# Altium schematic sheet Power_Management.SchDoc
size 419 x 297 mm; SheetNumber: 2; SheetTotal: 4
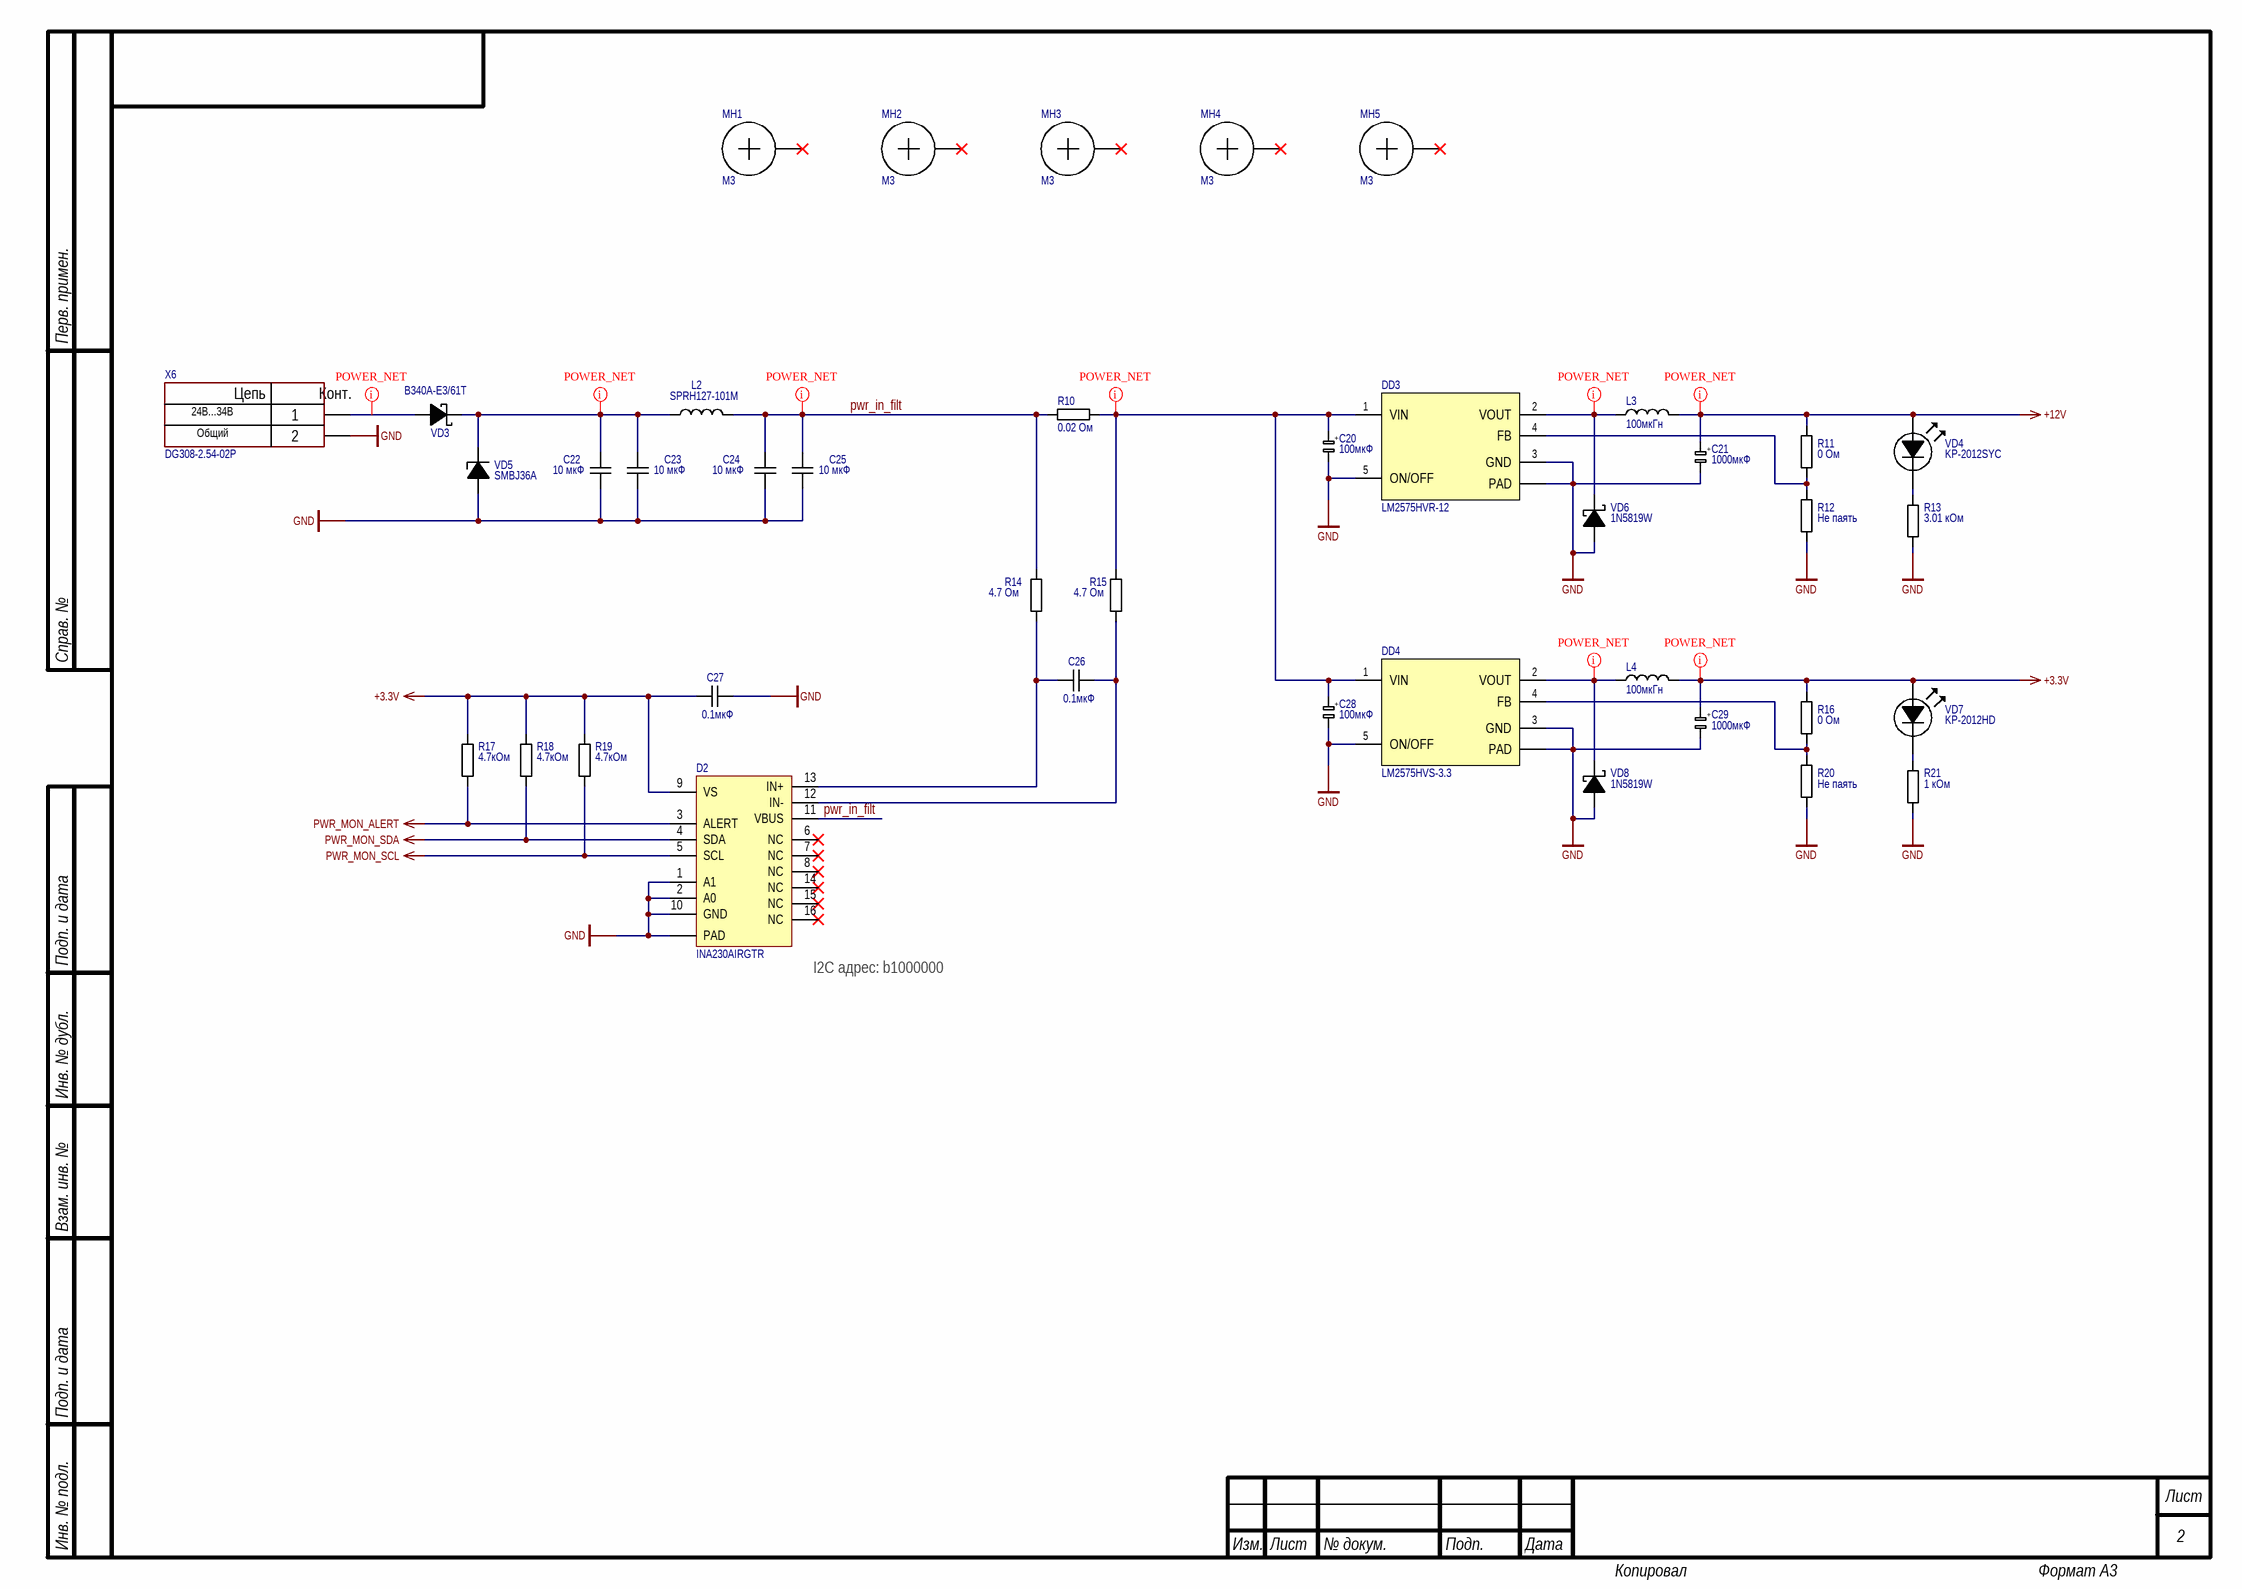
[diagram p0: Power_Management.SchDoc]

## Parts
C20  value 100мкФ  [CAP_RADIAL_10x20_P5]  (hidden comment: CAP-100мкФ-20%-100В-105°C-Radial)
C21  value 1000мкФ  [CAP_RADIAL_10x20_P5]  (hidden comment: CAP-1000мкФ-20%-25В-105°C-Radial)
C22  value 10 мкФ  [CAP_1206]  (hidden comment: CAP-10 мкФ-10%-50 В-X5R-1206)
C23  value 10 мкФ  [CAP_1206]  (hidden comment: CAP-10 мкФ-10%-50 В-X5R-1206)
C24  value 10 мкФ  [CAP_1206]  (hidden comment: CAP-10 мкФ-10%-50 В-X5R-1206)
C25  value 10 мкФ  [CAP_1206]  (hidden comment: CAP-10 мкФ-10%-50 В-X5R-1206)
C26  value 0.1мкФ  [CAP-0603]  (hidden comment: CAP-0.1мкФ-10%-50В-X7R-0603)
C27  value 0.1мкФ  [CAP-0603]  (hidden comment: CAP-0.1мкФ-10%-50В-X7R-0603)
C28  value 100мкФ  [CAP_RADIAL_10x20_P5]  (hidden comment: CAP-100мкФ-20%-100В-105°C-Radial)
C29  value 1000мкФ  [CAP_RADIAL_10x20_P5]  (hidden comment: CAP-1000мкФ-20%-25В-105°C-Radial)
D2  INA230AIRGTR  [VQFN-16]
DD3  LM2575HVR-12  [TO-263-5]
DD4  LM2575HVS-3.3  [TO-263-5]
L2  SPRH127-101M  [IND_SPRH127-101M]
L3  100мкГн  [IND_10.4X10.4]
L4  100мкГн  [IND_10.4X10.4]
MH1  M3  [M3]  (no BOM)
MH2  M3  [M3]  (no BOM)
MH3  M3  [M3]  (no BOM)
MH4  M3  [M3]  (no BOM)
MH5  M3  [M3]  (no BOM)
R10  value 0.02 Ом  [RES-2512]  (hidden comment: RES-0.02 Ом-1%-3 Вт-2512)
R11  value 0 Ом  [RES-0402]  (hidden comment: RES-0 Ом-5%-0.062 Вт-0402)
R12  value Не паять  [RES-0402]  (hidden comment: RES-Не паять-----0402)
R13  value 3.01 кОм  [RES-0805]  (hidden comment: RES-3.01 кОм-1%-0.125Вт-0805)
R14  value 4.7 Ом  [RES-0402]  (hidden comment: RES-4.7 Ом-5%-0.062 Вт-0402)
R15  value 4.7 Ом  [RES-0402]  (hidden comment: RES-4.7 Ом-5%-0.062 Вт-0402)
R16  value 0 Ом  [RES-0402]  (hidden comment: RES-0 Ом-5%-0.062 Вт-0402)
R17  value 4.7кОм  [RES-0402]  (hidden comment: RES-4.7кОм-5%-0.062Вт-0402)
R18  value 4.7кОм  [RES-0402]  (hidden comment: RES-4.7кОм-5%-0.062Вт-0402)
R19  value 4.7кОм  [RES-0402]  (hidden comment: RES-4.7кОм-5%-0.062Вт-0402)
R20  value Не паять  [RES-0402]  (hidden comment: RES-Не паять-----0402)
R21  value 1 кОм  [RES-0805]  (hidden comment: RES-1 кОм-1%-0.125Вт-0805)
VD3  B340A-E3/61T  [DO-214AC]
VD4  KP-2012SYC  [LED 0805]
VD5  SMBJ36A  [DO-214AA]
VD6  1N5819W  [SOD-123]
VD7  KP-2012HD  [LED 0805]
VD8  1N5819W  [SOD-123]
X6  DG308-2.54-02P  Curciut 2: Общий  Curciut 1: 24В...34В  [DG30825402P1400AH]

## Nets
+3.3V: C27.1 C29.P D2.9(VS) L4.2 R16.2 R17.2 R18.2 R19.2 VD7.1(A)
+12V: C21.P L3.2 R11.2 VD4.1(A)
GND: C20.N C21.N C22.1 C23.1 C24.1 C25.1 C27.2 C28.N C29.N D2.1(A1) D2.2(A0) D2.10(GND) D2.PAD DD3.3(GND) DD3.5(ON/OFF) DD3.PAD DD4.3(GND) DD4.5(ON/OFF) DD4.PAD R12.1 R13.1 R20.1 R21.1 VD5.A VD6.1(A) VD8.1(A) X6.2
PWR_MON_ALERT: D2.3(ALERT) R17.1
PWR_MON_SCL: D2.5(SCL) R19.1
PWR_MON_SDA: D2.4(SDA) R18.1
pwr_in_filt: C24.2 C25.2 D2.11(VBUS) L2.2 R10.1 R14.2
NetC20_P: C20.P C28.P DD3.1(VIN) DD4.1(VIN) R10.2 R15.2
NetC22_2: C22.2 C23.2 L2.1 VD3.C VD5.C
NetC26_1: C26.1 D2.13(IN+) R14.1
NetC26_2: C26.2 D2.12(IN-) R15.1
NetDD3_2: DD3.2(VOUT) L3.1 VD6.2(K)
NetDD3_4: DD3.4(FB) R11.1 R12.2
NetDD4_2: DD4.2(VOUT) L4.1 VD8.2(K)
NetDD4_4: DD4.4(FB) R16.1 R20.2
NetR13_2: R13.2 VD4.2(C)
NetR21_2: R21.2 VD7.2(C)
NetVD3_A: VD3.A X6.1

Not connected (* = marked no-connect by the designer): D2 6(NC)* 7(NC)* 8(NC)* 14(NC)* 15(NC)* 16(NC)*; MH1 1*; MH2 1*; MH3 1*; MH4 1*; MH5 1*

## Layout directives
net class POWER_NET: +3.3V, +12V, NetC20_P, NetC22_2, NetDD3_2, NetDD4_2, NetVD3_A, pwr_in_filt

## Notes on the sheet
- (near D2) I2C адрес: b1000000
- Перв. примен.
- Справ. №
- Подп. и дата
- Инв. № дубл.
- Взам. инв. №
- Изм.
- Лист
- № докум.
- Подп.
- Дата
- Инв. № подл.
- Копировал
- Формат А3
- (in symbol DG308-2.54-02P) Цепь; Конт.
- (in symbol JRB1E102M05001000210000B) +
- (in symbol JRB2A101M05001000200000B) +

## Library data of the parts
C20 C28 = JRB2A101M05001000200000B: 100мкФ, 100В, 105°C, 20%, 10x20мм P:5мм, JRB2A101M05001000200000B (К50-35 имп.), Конденсатор электролитический алюминиевый; Tolerance: 20%; Voltage: 100В; Manufacturer Part Number: JRB2A101M05001000200000B; Supplier 1: https://www.chipdip.ru/product/100mkf-100v-105-c-20-10x20mm-p-5mm-jb-capacitors-9000565887; Temperature: 105°C
C21 C29 = JRB1E102M05001000210000B: 1000мкФ, 25В, 105°C, 20%, 10x21мм P:5мм, JRB1E102M05001000210000B (К50-35 имп.), Конденсатор электролитический алюминиевый; Tolerance: 20%; Voltage: 25В; Manufacturer Part Number: JRB1E102M05001000210000B; Supplier 1: https://www.chipdip.ru/product/1000mkf-25v-105-c-20-10x21mm-p-5mm-jb-capacitors-9000565924; Temperature: 105°C
C22-C25 = Cap_1206: Конденсатор; Manufacturer Part Number: GRM31CR61H106KA12L; Tolerance: 10%; Voltage: 50 В; Temperature: X5R; Supplier 1: https://www.chipdip.ru/product0/9000332404
C26 C27 = Cap_0603: Конденсатор; Manufacturer Part Number: GRM188R71H104K; Tolerance: 10%; Voltage: 50В; Temperature: X7R; Supplier 1: https://www.chipdip.ru/product/grm188r71h104k
D2 = INA230AIRGTR: 36-V, 16-bit, I²C output current, voltage and power monitor with alert 16-VQFN -40 to 125; Manufacturer: Texas Instruments; Supplier: Digikey; Supplier Part Number: 296-36594-1-ND; Manufacturer Part Number: INA230AIRGTR; RoHS: Yes; Category: Amplifiers - Op Amps, Buffer, Instrumentation; Stock: 3132; Pricing: 1=2,83, 10=2,543, 25=2,3988, 100=2,0437, 250=1,919, 500=1,67912, 1000=1,39128 (USD); ComponentLink1URL: https://datasheet.ciiva.com/15132/getdatasheetpartid-614336-15132773.pdf?src-supplier=Verical; ComponentLink1Description: https://datasheet.ciiva.com/15132/getdatasheetpartid-614336-15132773.pdf?src-supplier=Verical; ComponentLink2URL: https://datasheet.ciiva.com/2965/ina230-2965732.pdf?src-supplier=Avnet; ComponentLink2Description: https://datasheet.ciiva.com/2965/ina230-2965732.pdf?src-supplier=Avnet; ComponentLink3URL: https://datasheet.ciiva.com/29609/ina230-29609254.pdf?src-supplier=Digikey; ComponentLink3Description: https://datasheet.ciiva.com/29609/ina230-29609254.pdf?src-supplier=Digikey; ComponentLink4URL: https://datasheet.ciiva.com/29609/ina230-29609255.pdf?src-supplier=Digikey; ComponentLink4Description: https://datasheet.ciiva.com/29609/ina230-29609255.pdf?src-supplier=Digikey; ComponentLink5URL: https://datasheet.ciiva.com/29609/ina230-29609256.pdf?src-supplier=Digikey; ComponentLink5Description: https://datasheet.ciiva.com/29609/ina230-29609256.pdf?src-supplier=Digikey; Supplier 1: https://www.chipdip.ru/product0/8004605923?ysclid=m1f43nxnn781516536
DD3 = LM2575HVR-12: LM2575HVR-12, Понижающий DC-DC преобразователь, Uвх=до 60В, Uвых=+12В, 1А, 52кГц [TO-263-5L] (=LM2575HVS-12); Supplier 1: https://www.chipdip.ru/product/lm2575hvr-12-ponizhayuschiy-dc-dc-preobrazovatel-uvh-do-htc-9001087020
DD4 = LM2575HVS-3.3: LM2575HVS-3.3, Понижающий DC-DC преобразователь, Uвх=до 60В, Uвых=3.3В, 1А, 52кГц [TO-263-5L]; Supplier 1: https://www.chipdip.ru/product/lm2575hvs-3.3-ponizhayuschiy-dc-dc-preobrazovatel-umw-9001231209
L2 = SPRH127-101M: SMD Low Loss Power Inductor; Manufacturer: Codaca; Supplier: Digikey; Supplier Part Number: 4044-SPRH127-101MCT-ND; Manufacturer Part Number: SPRH127-101M; RoHS: No; Stock: 3159; Pricing: 1=1,13, 10=0,93, 100=0,7645 (USD); Supplier 1: https://www.chipdip.ru/product/sprh127-101m-100
L3 L4 = B82464G4104M000: Inductor Power Shielded Wirewound 100uH 20% 100KHz Ferrite 1.05A 0.22Ohm DCR Automotive T/R; Manufacturer: EPCOS; DC Resistance (DCR): 220mΩ; Inductance: 100µH; Number of Circuits: 1; Saturation Current: 1.15A; Self Resonant Frequency: 6.5MHz; Manufacturer Part Number: B82464G4104M000; RoHS: Compliant; Category: Fixed Inductors; Stock 1: 363; Pricing 1: 1=1,09 (GBP); Case/Package: SMD/SMT; China RoHS: Compliant; Contact Plating: Tin; Core Material: Ferrite; Country of Origin: Germany; DC Current: 1.05A; Depth: 10.4mm; Export Control Classification Number (ECCN) Code: EAR99; Height: 4.8mm; Harmonized Tariff Schedule (HTS) Code: 8504.50.80.00; Inductance Tolerance: 20%; Introduction Date: 2002-08-13; Lead Free: Lead Free; Length: 10.4mm; Lifecycle Status: EOL; Max Current Rating: 1.05A; Max DC Current: 1.05A; Max Length: 10.4mm; Max Operating Temperature: 125°C; Max Width: 10.4mm; Military Standard: Not; Min Operating Temperature: -55°C; Mount: Surface Mount; Number of Pins: 2; Number of Terminals: 2; Packaging: Cut Tape; REACH SVHC: Yes; Resistance: 220mΩ; RMS Current (Irms): 1.05A; Schedule B: 8504500000, 8504500000|8504500000|8504500000|8504500000|8504500000; Test Frequency: 100kHz; Tolerance: 20%; Width: 10.4mm; ComponentLink1URL: https://datasheet.octopart.com:443/B82464G4104M000-EPCOS-datasheet-138895962.pdf?src-supplier=IHS; ComponentLink1Description: https://datasheet.octopart.com:443/B82464G4104M000-EPCOS-datasheet-138895962.pdf?src-supplier=IHS; ComponentLink2URL: https://datasheet.octopart.com:443/B82464G4104M000-EPCOS-datasheet-12510517.pdf?src-supplier=Newark; ComponentLink2Description: https://datasheet.octopart.com:443/B82464G4104M000-EPCOS-datasheet-12510517.pdf?src-supplier=Newark; ComponentLink3URL: https://datasheet.octopart.com:443/B82464G4104M000-EPCOS-datasheet-10671.pdf?src-supplier=Newark; ComponentLink3Description: https://datasheet.octopart.com:443/B82464G4104M000-EPCOS-datasheet-10671.pdf?src-supplier=Newark; ComponentLink4URL: https://datasheet.octopart.com:443/B82464G4104M000-EPCOS-datasheet-8324944.pdf?src-supplier=Future+Electronics; ComponentLink4Description: https://datasheet.octopart.com:443/B82464G4104M000-EPCOS-datasheet-8324944.pdf?src-supplier=Future+Electronics; ComponentLink5URL: https://datasheet.octopart.com:443/B82464G4104M000-EPCOS-datasheet-47871567.pdf?src-supplier=Future+Electronics; ComponentLink5Description: https://datasheet.octopart.com:443/B82464G4104M000-EPCOS-datasheet-47871567.pdf?src-supplier=Future+Electronics; ComponentLink6URL: https://datasheet.octopart.com:443/B82464G4104M000-EPCOS-datasheet-38579530.pdf?src-supplier=element14+APAC; ComponentLink6Description: https://datasheet.octopart.com:443/B82464G4104M000-EPCOS-datasheet-38579530.pdf?src-supplier=element14+APAC; ComponentLink7URL: https://datasheet.octopart.com:443/B82464G4104M-EPCOS-datasheet-714.pdf?src-supplier=TME; ComponentLink7Description: https://datasheet.octopart.com:443/B82464G4104M-EPCOS-datasheet-714.pdf?src-supplier=TME; ComponentLink8URL: https://datasheet.octopart.com:443/B82464G4104M-EPCOS-datasheet-519163.pdf?src-supplier=Farnell; ComponentLink8Description: https://datasheet.octopart.com:443/B82464G4104M-EPCOS-datasheet-519163.pdf?src-supplier=Farnell; ComponentLink9URL: https://datasheet.octopart.com:443/B82464G4104M-EPCOS-datasheet-499776.pdf?src-supplier=Farnell; ComponentLink9Description: https://datasheet.octopart.com:443/B82464G4104M-EPCOS-datasheet-499776.pdf?src-supplier=Farnell; ComponentLink10URL: https://datasheet.octopart.com:443/B82464-G4104-M-EPCOS-datasheet-550296.pdf?src-supplier=Verical; ComponentLink10Description: https://datasheet.octopart.com:443/B82464-G4104-M-EPCOS-datasheet-550296.pdf?src-supplier=Verical; Supplier Part Number 1: 4960669; Supplier 1: https://www.chipdip.ru/product/b82464g4104m-100mkgn-1.05a-10x10-katushka-epcos-759264303?from=visited_product; Supplier: RS
MH1-MH5 = M3: отверстие М3
R10 = Res_2512: Резистор; Manufacturer Part Number: CRA2512-FZ-R020ELF; Power: 3 Вт; Tolerance: 1%; Supplier 1: https://www.chipdip.ru/product0/8002006585
R11 R16 = Res_0402: Резистор; Manufacturer Part Number: RC0402JR-070RL; Tolerance: 5%; Power: 0.062 Вт; Supplier 1: https://www.chipdip.ru/product/0.062w-0402-0-om-5
R12 R20 = Res_0402: Резистор; Tolerance: -; Power: -; Manufacturer Part Number: -; Supplier 1: -
R13 = Res_0805: Резистор; Manufacturer Part Number: RC0805FR-073K01L; Tolerance: 1%; Power: 0.125Вт; Supplier 1: https://www.chipdip.ru/product0/8013608452
R14 R15 = Res_0402: Резистор; Manufacturer Part Number: RC0402JR-074R7L; Tolerance: 5%; Power: 0.062 Вт; Supplier 1: https://www.chipdip.ru/product/0.062w-0402-4.7-om-5
R17-R19 = Res_0402: Резистор; Manufacturer Part Number: RC0402JR-074K7L; Tolerance: 5%; Power: 0.062Вт; Supplier 1: https://www.chipdip.ru/product/0.062w-0402-4.7-kom-5
R21 = Res_0805: Резистор; Manufacturer Part Number: CR0805-FX-1001ELF; Tolerance: 1%; Power: 0.125Вт; Supplier 1: https://www.chipdip.ru/product0/8003688062
VD3 = B340A-E3/61T: Rectifier Diode, Schottky, 1 Phase, 1 Element, 3A, 40V V(RRM), Silicon, DO-214AC; Manufacturer: Vishay Semiconductors; Supplier: Avnet; Supplier Part Number: B340A-E3/61T; Manufacturer Part Number: B340A-E3/61T; RoHS: Yes; Category: Rectifier Diodes; Stock: 19800; Pricing: 3600=0,11, 7200=0,10732, 10800=0,10602, 18000=0,10476, 36000=0,10353 (USD); ComponentLink1URL: https://datasheet.ciiva.com/22685/1719678-22685665.pdf?src-supplier=Element14; ComponentLink1Description: https://datasheet.ciiva.com/22685/1719678-22685665.pdf?src-supplier=Element14; ComponentLink2URL: https://datasheet.ciiva.com/4245/b330la-4245394.pdf?src-supplier=Arrow+Electronics; ComponentLink2Description: https://datasheet.ciiva.com/4245/b330la-4245394.pdf?src-supplier=Arrow+Electronics; ComponentLink3URL: https://datasheet.ciiva.com/911/b330la-911044.pdf?src-supplier=Digikey; ComponentLink3Description: https://datasheet.ciiva.com/911/b330la-911044.pdf?src-supplier=Digikey; ComponentLink4URL: https://datasheet.ciiva.com/911/b330la-911045.pdf?src-supplier=Digikey; ComponentLink4Description: https://datasheet.ciiva.com/911/b330la-911045.pdf?src-supplier=Digikey; ComponentLink5URL: https://datasheet.ciiva.com/911/b330la-911046.pdf?src-supplier=Digikey; ComponentLink5Description: https://datasheet.ciiva.com/911/b330la-911046.pdf?src-supplier=Digikey; Supplier 1: https://www.chipdip.ru/product/b340a-e3-61t-2?from=suggest_product
VD4 VD7 = LED 0805: LED SMD 0805
  VD4: Part Number: KP-2012SYC; Supplier 1: https://www.chipdip.ru/product0/8001782012
  VD7: Part Number: KP-2012HD; Supplier 1: https://www.chipdip.ru/product0/8001788575
VD5 = SMBJ36A: SMBJ36A, Защитный диод 600Вт 36В [SMB / DO-214AA]; Supplier 1: https://www.chipdip.ru/product/smbj36a-zaschitnyy-diod-600vt-36v-smb-do-214aa-umw-9001169227
VD6 VD8 = 1N5819W: Диод Шоттки 40В 1А; Supplier 1: https://www.chipdip.ru/product/1n5819w
X6 = DG308-2.54-02P: Клеммник 2 конт. шаг 2.54 мм, вертик. на плату, H = 8.5 мм, провод под винт/микролифт (пров. 26-18AWG/ до 1.0 кв.мм), до 150В/6А, зеленый изол.; Supplier 1: https://www.chipdip.ru/product/dg308-2.54-02p-14-00ah-308-021-14-klemmnik-vintovoy-degson-63066?from=visited_product